# EAGLE design zero shield esp8266 (EAGLE 6.5.0)
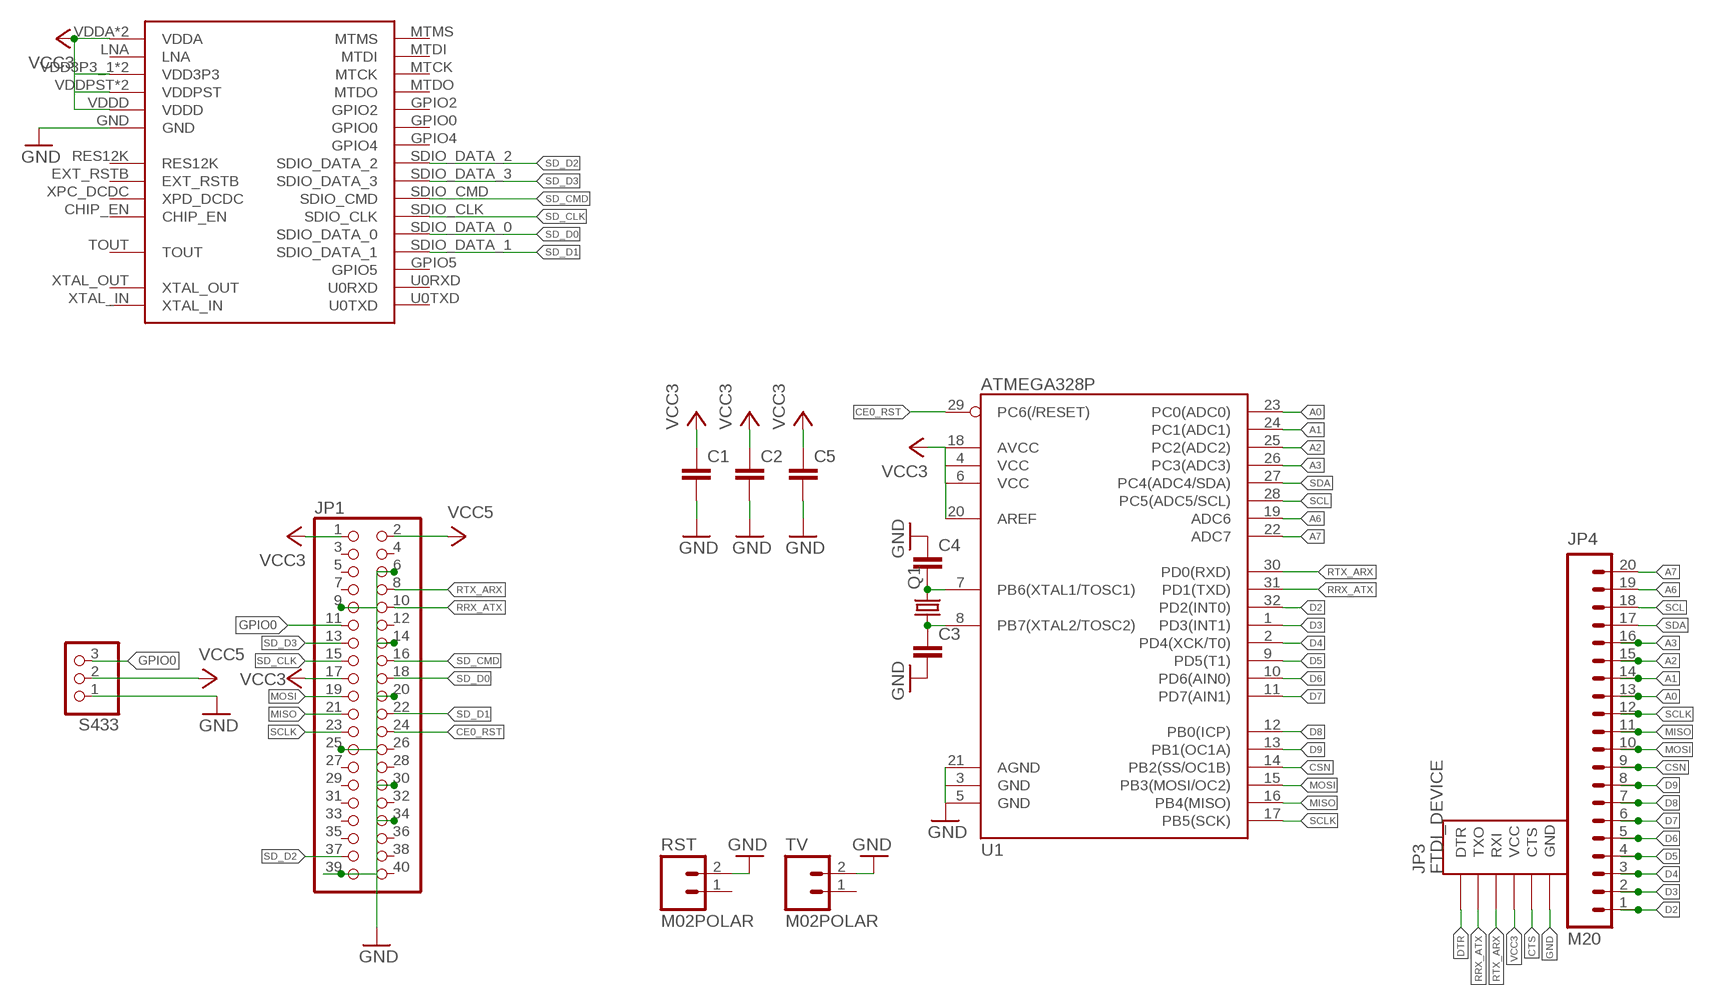
[diagram p0: schematic, sheet 1]

## Parts
C1  C-EUC1206K  [C1206K]
C2  C-EUC1206K  [C1206K]
C3  C-EUC1206K  [C1206K]
C4  C-EUC1206K  [C1206K]
C5  C-EUC1206K  [C1206K]
JP1  PINHD-2X20  [2X20]
JP3  FTDI_DEVICE  [FTDI_DEVICE_SIDE]
JP4  M20  [1X20]
Q1  CRYSTALHC49S  [HC49/S]
RST  M02POLAR  [MOLEX-1X2]
S433  PINHD-1X3CB  [1X03-CLEANBIG]
TV  M02POLAR  [MOLEX-1X2]
U1  ATMEGA328P  ATMEGA328_SMT  [TQFP32-08]
U$3  ESP8266EX  [ESP8266EX]

## Nets
A0: JP4.13 U1.23(PC0(ADC0))
A1: JP4.14 U1.24(PC1(ADC1))
A2: JP4.15 U1.25(PC2(ADC2))
A3: JP4.16 U1.26(PC3(ADC3))
A6: JP4.19 U1.19(ADC6)
A7: JP4.20 U1.22(ADC7)
CE0_RST: JP1.24 U1.29(PC6(/RESET))
CSN: JP4.9 U1.14(PB2(SS/OC1B))
CTS: JP3.P$5(CTS)
D2: JP4.1 U1.32(PD2(INT0))
D3: JP4.2 U1.1(PD3(INT1))
D4: JP4.3 U1.2(PD4(XCK/T0))
D5: JP4.4 U1.9(PD5(T1))
D6: JP4.5 U1.10(PD6(AIN0))
D7: JP4.6 U1.11(PD7(AIN1))
D8: JP4.7 U1.12(PB0(ICP))
D9: JP4.8 U1.13(PB1(OC1A))
DTR: JP3.P$1(DTR)
GND: C1.2 C2.2 C3.2 C4.1 C5.2 JP1.6 JP1.9 JP1.14 JP1.20 JP1.25 JP1.30 JP1.34 JP1.39 JP3.P$6(GND) RST.2 S433.1 TV.2 U1.3(GND) U1.5(GND) U1.21(AGND) U$3.GND
GPIO0: JP1.11 S433.3
MISO: JP1.21 JP4.11 U1.16(PB4(MISO))
MOSI: JP1.19 JP4.10 U1.15(PB3(MOSI/OC2))
N$1: C4.2 Q1.2 U1.7(PB6(XTAL1/TOSC1))
N$2: C3.1 Q1.1 U1.8(PB7(XTAL2/TOSC2))
RRX_ATX: JP1.10 JP3.P$2(TXO) U1.31(PD1(TXD))
RTX_ARX: JP1.8 JP3.P$3(RXI) U1.30(PD0(RXD))
SCL: JP4.18 U1.28(PC5(ADC5/SCL))
SCLK: JP1.23 JP4.12 U1.17(PB5(SCK))
SD_CLK: JP1.15 U$3.SDIO_CLK
SD_CMD: JP1.16 U$3.SDIO_CMD
SD_D0: JP1.18 U$3.SDIO_DATA_0
SD_D1: JP1.22 U$3.SDIO_DATA_1
SD_D2: JP1.37 U$3.SDIO_DATA_2
SD_D3: JP1.13 U$3.SDIO_DATA_3
SDA: JP4.17 U1.27(PC4(ADC4/SDA))
VCC3: C1.1 C2.1 JP1.1 JP1.17 JP3.P$4(VCC) U1.4(VCC) U1.6(VCC) U1.18(AVCC) U1.20(AREF) U$3.VDD3P3_1(VDD3P3) U$3.VDD3P3_2(VDD3P3) U$3.VDDA U$3.VDDA_2(VDDA) U$3.VDDD U$3.VDDPST U$3.VDDPST_2(VDDPST)
VCC5: C5.1 JP1.2 S433.2 ; supply symbol labelled VCC3
Unconnected: JP1.3 JP1.4 JP1.5 JP1.7 JP1.12 JP1.26 JP1.27 JP1.28 JP1.29 JP1.31 JP1.32 JP1.33 JP1.35 JP1.36 JP1.38 JP1.40 RST.1 TV.1 U$3.CHIP_EN U$3.EXT_RSTB U$3.GPIO0 U$3.GPIO2 U$3.GPIO4 U$3.GPIO5 U$3.LNA U$3.MTCK U$3.MTDI U$3.MTDO U$3.MTMS U$3.RES12K U$3.TOUT U$3.U0RXD U$3.U0TXD U$3.XPC_DCDC(XPD_DCDC) U$3.XTAL_IN U$3.XTAL_OUT

## Library data of the parts
C1-C5 = rcl:C-EU: CAPACITOR, European symbol
JP1 = adafruit:PINHD-2X20: PIN HEADER
JP3 = SparkFun-Connectors:FTDI_DEVICE: Connector which mates to FTDI basic or FTDI cable.
JP4 = SparkFun-Connectors:M20: 1x20 .1" header This is just like the LOCK variant in that the holes are staggared by 5 mil, but except for the last two holes. They are not altered from the "standard" footprint layout. This is used for a special purpose on the layout of our Graphic LCD Backpack. Make sure you want to use this device before selecting it for you project!
Q1 = adafruit:CRYSTAL: CRYSTAL; OC_FARNELL: 1667008; OC_NEWARK: unknown
RST TV = SparkFun-Connectors:M02: Standard 2-pin 0.1" header. Use with - straight break away headers ( PRT-00116) - right angle break away headers (PRT-00553) - swiss pins (PRT-00743) - machine pins (PRT-00117) - female headers (PRT-00115) Molex polarized connector foot print use with: PRT-08233 with associated crimp pins and housings. 2.54_SCREWTERM for use with PRT-10571. 3.5mm Screw Terminal footprints for PRT-08084 5mm Screw Terminal footprints for use with PRT-08432
S433 = adafruit:PINHD-1X3: PIN HEADER
U1 = SparkFun-DigitalIC:ATMEGA328_SMT: 32-Pin Atmega328 part Commonly used on Arduino compatible boards Available in QFP and QFN packages TQFP is IC-09069 QFN is non-stock; PROD_ID: IC-09069
U$3 = ESP8266EX:ESP8266EX

## Board
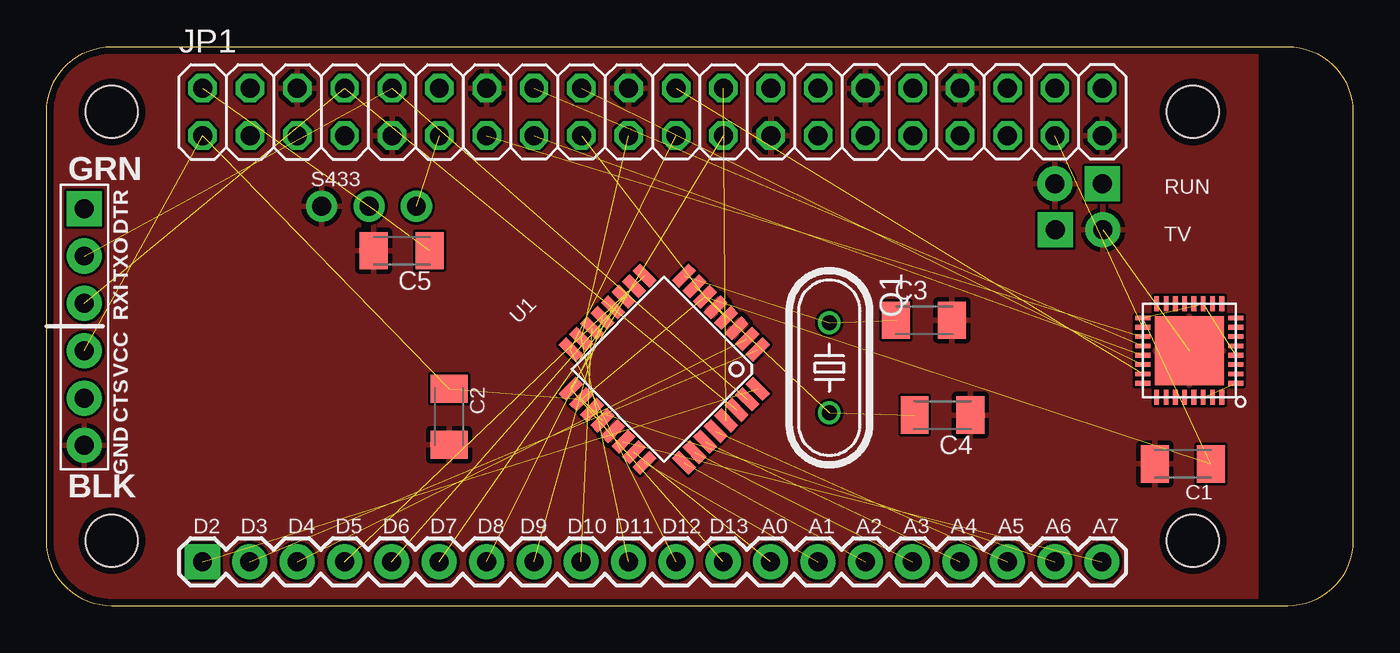
[diagram p1: board, top side]
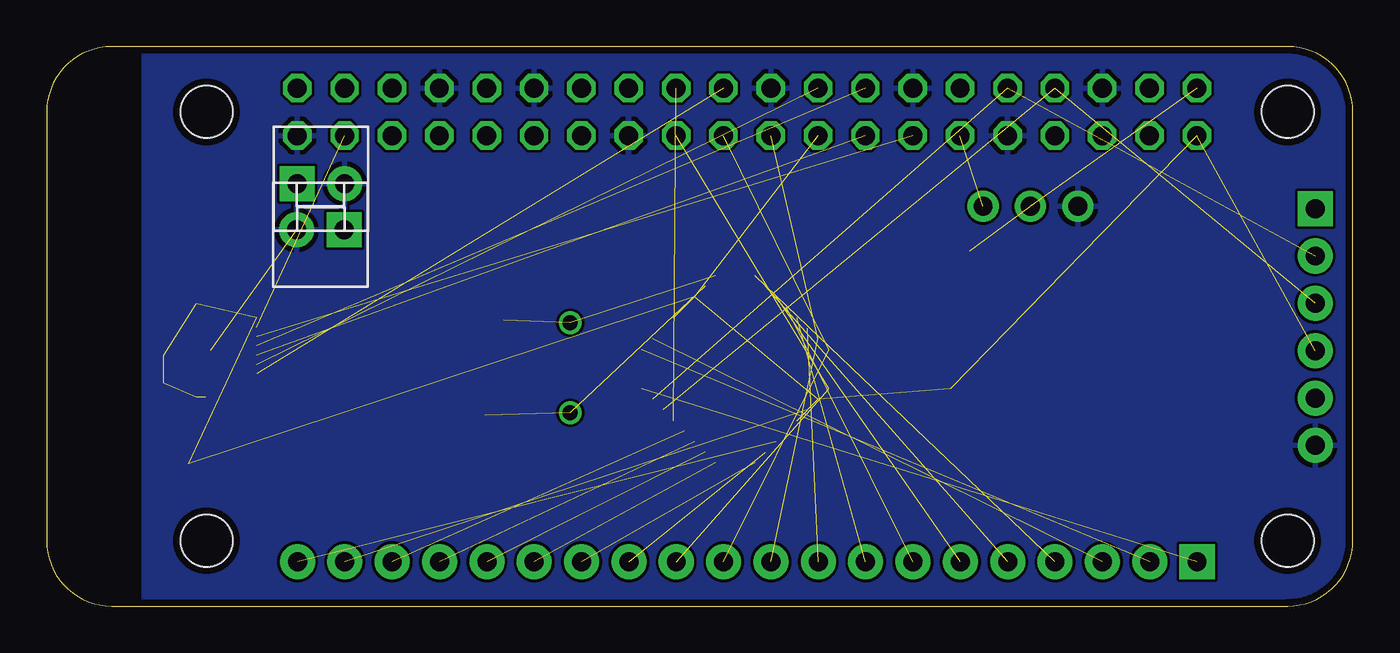
[diagram p2: board, bottom side, seen from below]

Size 70.08 x 30 mm. Coordinates in mm from the lower left corner, seen from the top.
Outline: 3.5,30 66.58,30 arc-90 70.08,26.5 70.08,3.5 arc-90 66.58,0 3.5,0 arc-90 0,3.5 0,26.5 arc-90 3.5,30
Copper layers (1*16): Top 0.0356mm / dielectric 1.5011mm / Bottom 0.0356mm
Design rules "LaenPCBOrder": minimum track width 6mil, minimum drill 13mil, track to track 6mil, track to pad 6mil, pad to pad 6mil, via to via 6mil, smd to smd 6mil, copper to edge 15mil, drill to drill 6mil, minimum pad ring 7mil, minimum via ring 7mil, stop-mask expansion 3mil, vias tented up to drill 0mil, thermal gap 10mil
Holes 2.8 mm at 3.5,26.5 3.5,3.5 61.5,26.5 61.5,3.5

### Footprints (pad centres in the part's own frame; a part is rotated, then mirrored left to right if it is on the bottom)
C1206K = smd 1.5 x 2: 1 -1.5,0; 2 1.5,0
2X20 = drill 1.016 octagon: 1 -24.13,-1.27; 2 -24.13,1.27; 3 -21.59,-1.27; 4 -21.59,1.27; 5 -19.05,-1.27; 6 -19.05,1.27; 7 -16.51,-1.27; 8 -16.51,1.27; 9 -13.97,-1.27; 10 -13.97,1.27; 11 -11.43,-1.27; 12 -11.43,1.27; 13 -8.89,-1.27; 14 -8.89,1.27; 15 -6.35,-1.27; 16 -6.35,1.27; 17 -3.81,-1.27; 18 -3.81,1.27; 19 -1.27,-1.27; 20 -1.27,1.27; 21 1.27,-1.27; 22 1.27,1.27; 23 3.81,-1.27; 24 3.81,1.27; 25 6.35,-1.27; 26 6.35,1.27; 27 8.89,-1.27; 28 8.89,1.27; 29 11.43,-1.27; 30 11.43,1.27; 31 13.97,-1.27; 32 13.97,1.27; 33 16.51,-1.27; 34 16.51,1.27; 35 19.05,-1.27; 36 19.05,1.27; 37 21.59,-1.27; 38 21.59,1.27; 39 24.13,-1.27; 40 24.13,1.27
FTDI_DEVICE_SIDE = drill 1.016 pad 1.88 square: P$1 -6.35,0 | drill 1.016 pad 1.88: P$2 -3.81,0; P$3 -1.27,0; P$4 1.27,0; P$5 3.81,0; P$6 6.35,0
1X20 = drill 1.016 pad 1.88 square: 1 0,0 | drill 1.016 pad 1.88: 2 2.54,0; 3 5.08,0; 4 7.62,0; 5 10.16,0; 6 12.7,0; 7 15.24,0; 8 17.78,0; 9 20.32,0; 10 22.86,0; 11 25.4,0; 12 27.94,0; 13 30.48,0; 14 33.02,0; 15 35.56,0; 16 38.1,0; 17 40.64,0; 18 43.18,0; 19 45.72,0; 20 48.26,0
HC49/S = drill 0.813: 1 -2.413,0; 2 2.413,0
MOLEX-1X2 = drill 1.016 pad 1.88 square: 1 0,0 | drill 1.016 pad 1.88: 2 2.54,0
1X03-CLEANBIG = drill 1.016 pad 1.676: 1 -2.54,0; 2 0,0; 3 2.54,0
TQFP32-08 = smd 1.27 x 0.559: 1 -4.293,2.8; 2 -4.293,2; 3 -4.293,1.2; 4 -4.293,0.4; 5 -4.293,-0.4; 6 -4.293,-1.2; 7 -4.293,-2; 8 -4.293,-2.8; 17 4.293,-2.8; 18 4.293,-2; 19 4.293,-1.2; 20 4.293,-0.4; 21 4.293,0.4; 22 4.293,1.2; 23 4.293,2; 24 4.293,2.8 | smd 0.559 x 1.27: 9 -2.8,-4.293; 10 -2,-4.293; 11 -1.2,-4.293; 12 -0.4,-4.293; 13 0.4,-4.293; 14 1.2,-4.293; 15 2,-4.293; 16 2.8,-4.293; 25 2.8,4.293; 26 2,4.293; 27 1.2,4.293; 28 0.4,4.293; 29 -0.4,4.293; 30 -1.2,4.293; 31 -2,4.293; 32 -2.8,4.293
ESP8266EX = smd 0.8 x 0.25: CHIP_EN -2.5,-1.25; GPIO5 2.5,1.75; LNA -2.5,1.25; SDIO_CLK 2.5,0.25; SDIO_CMD 2.5,-0.25; SDIO_DATA_0 2.5,0.75; SDIO_DATA_1 2.5,1.25; SDIO_DATA_2 2.5,-1.25; SDIO_DATA_3 2.5,-0.75; TOUT -2.5,-0.75; VDD3P3_1 -2.5,0.75; VDD3P3_2 -2.5,0.25; VDD_RTC -2.5,-0.25; VDDA -2.5,1.75; VDDPST_2 2.5,-1.75; XPC_DCDC -2.5,-1.75 | smd 0.25 x 0.8: EXT_RSTB -1.75,2.5; GPIO0 1.25,-2.5; GPIO2 0.75,-2.5; GPIO4 1.75,-2.5; MTCK -0.25,-2.5; MTDI -1.25,-2.5; MTDO 0.25,-2.5; MTMS -1.75,-2.5; RES12K -1.25,2.5; U0RXD 1.75,2.5; U0TXD 1.25,2.5; VDDA_2 -0.75,2.5; VDDD -0.25,2.5; VDDPST -0.75,-2.5; XTAL_IN 0.25,2.5; XTAL_OUT 0.75,2.5 | smd 3.7 x 3.7: GND 0,0

### Placement (x,y rotation side)
C1  60.96,7.62 180 top
C2  21.59,10.16 270 top
C3  47.07,15.32 0 top
C4  48.07,10.24 180 top
C5  19.05,19.05 180 top
JP1  32.5,26.5 0 top
JP3  2.03,14.96 270 top
JP4  8.36,2.37 0 top
Q1  41.99,12.78 270 top
RST  56.64,22.66 0 bottom
S433  17.3,21.44 0 top
TV  54.13,20.17 180 bottom
U1  33.14,12.7 225 top
U$3  61.3,13.7 180 top

### Tracks (layer width: path | path; a pad name or v marks a point on that pad's centre or on a via)
A0  (1 unrouted)
A1  (1 unrouted)
A2  (1 unrouted)
A3  (1 unrouted)
A6  (1 unrouted)
A7  (1 unrouted)
CE0_RST  (1 unrouted)
CSN  (1 unrouted)
D2  (1 unrouted)
D3  (1 unrouted)
D4  (1 unrouted)
D5  (1 unrouted)
D6  (1 unrouted)
D7  (1 unrouted)
D8  (1 unrouted)
D9  (1 unrouted)
GND  (1 unrouted)
  pour Bottom: -1.82,33.01 64.84,33.06 64.84,-2.5 -1.82,-2.55
  pour Top: -0.82,31.99 -0.82,-1.03 64.87,-1.03 64.87,31.99
GPIO0  (1 unrouted)
MISO  (2 unrouted)
MOSI  (2 unrouted)
N$1  (2 unrouted)
N$2  (2 unrouted)
RRX_ATX  (2 unrouted)
RTX_ARX  (2 unrouted)
SCL  (1 unrouted)
SCLK  (2 unrouted)
SD_CLK  (1 unrouted)
SD_CMD  (1 unrouted)
SD_D0  (1 unrouted)
SD_D1  (1 unrouted)
SD_D2  (1 unrouted)
SD_D3  (1 unrouted)
SDA  (1 unrouted)
VCC3  (15 unrouted)
VCC5  (2 unrouted)

### Text on the board
tNames: RUN | TV | D2 | D3 | D4 | D5 | D6 | D7 | D8 | D9 | D10 | D11 | D12 | D13 | A0 | A1 | A2 | A3 | A4 | A5 | A6 | A7